# Altium schematic sheet Voltage_DC.SchDoc
size A3; Organization: ORGANIZATION; Address1: ADDRESS 1; Address2: ADDRESS 2; Address3: ADDRESS 3; Address4: ADDRESS 4; Revision: -; SheetNumber: 15; SheetTotal: 19; ENG_APP_DATE: --/--/--; DSN_APP_DATE: --/--/--; CHK_APP_DATE: --/--/--
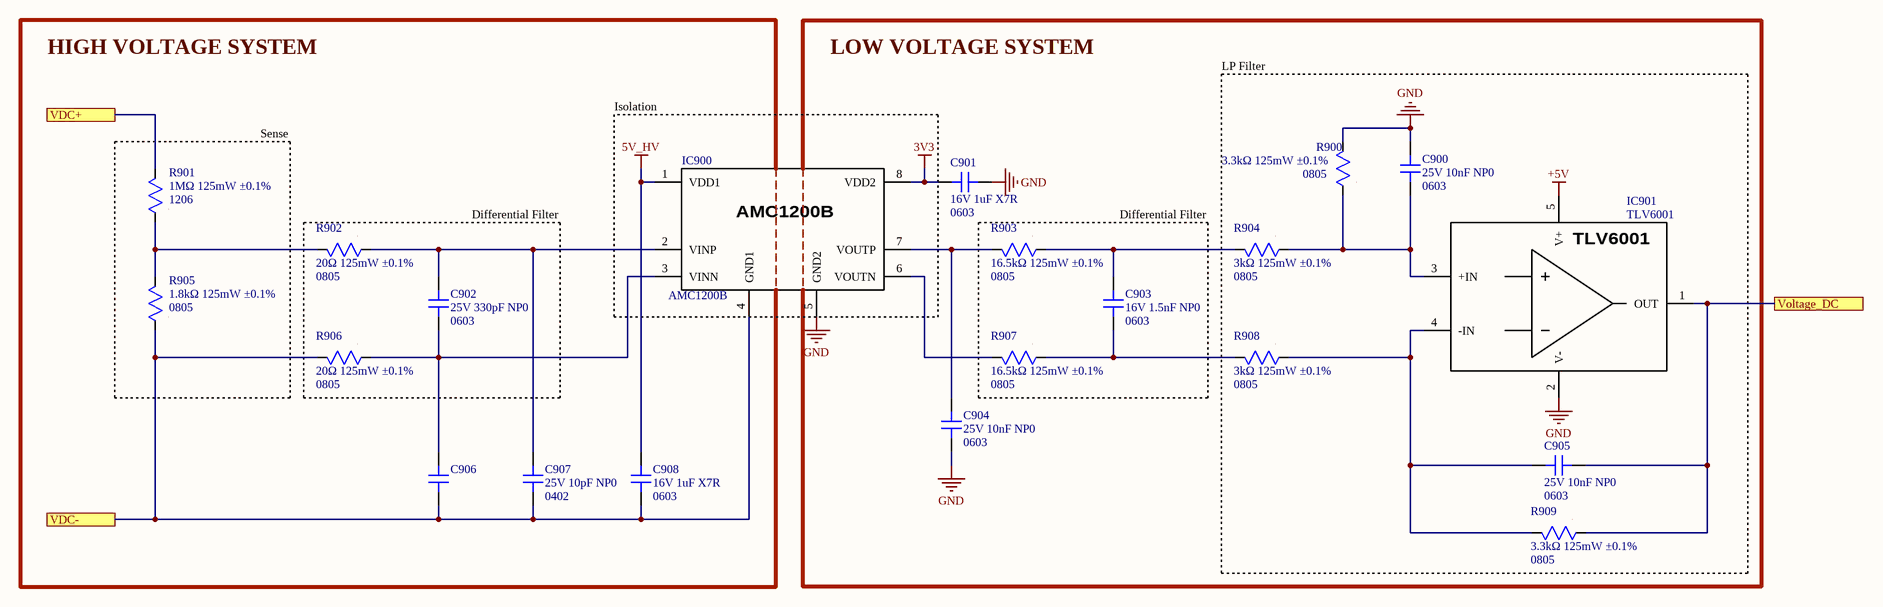
[diagram p0: Voltage_DC.SchDoc]

## Parts
C900  value 25V 10nF NP0  Package: 0603  [CAP SMD 0603]  (hidden comment: CAP non polarized)
C901  value 16V 1uF X7R  Package: 0603  [CAP SMD 0603]  (hidden comment: CAP non polarized)
C902  value 25V 330pF NP0  Package: 0603  [CAP SMD 0603]  (hidden comment: CAP non polarized)
C903  value 16V 1.5nF NP0  Package: 0603  [CAP SMD 0603]  (hidden comment: CAP non polarized)
C904  value 25V 10nF NP0  Package: 0603  [CAP SMD 0603]  (hidden comment: CAP non polarized)
C905  value 25V 10nF NP0  Package: 0603  [CAP SMD 0603]  (hidden comment: CAP non polarized)
C906  CAP non polarized  [CAP SMD 0402]  (value not drawn)
C907  value 25V 10pF NP0  Package: 0402  [CAP SMD 0402]  (hidden comment: CAP non polarized)
C908  value 16V 1uF X7R  Package: 0603  [CAP SMD 0603]  (hidden comment: CAP non polarized)
IC900  AMC1200B  [AMC1200B]
IC901  TLV6001  [SOT-23-5]
R900  value 3.3kΩ 125mW ±0.1%  Package: 0805  [RES SMD 0805]  (hidden comment: RES)
R901  value 1MΩ 125mW ±0.1%  Package: 1206  [RES SMD 1206]  (hidden comment: RES)
R902  value 20Ω 125mW ±0.1%  Package: 0805  [RES SMD 0805]  (hidden comment: RES)
R903  value 16.5kΩ 125mW ±0.1%  Package: 0805  [RES SMD 0805]  (hidden comment: RES)
R904  value 3kΩ 125mW ±0.1%  Package: 0805  [RES SMD 0805]  (hidden comment: RES)
R905  value 1.8kΩ 125mW ±0.1%  Package: 0805  [RES SMD 0805]  (hidden comment: RES)
R906  value 20Ω 125mW ±0.1%  Package: 0805  [RES SMD 0805]  (hidden comment: RES)
R907  value 16.5kΩ 125mW ±0.1%  Package: 0805  [RES SMD 0805]  (hidden comment: RES)
R908  value 3kΩ 125mW ±0.1%  Package: 0805  [RES SMD 0805]  (hidden comment: RES)
R909  value 3.3kΩ 125mW ±0.1%  Package: 0805  [RES SMD 0805]  (hidden comment: RES)

## Blocks framed on the sheet
HIGH VOLTAGE SYSTEM: C902 C906-C908 R901 R902 R905 R906
LOW VOLTAGE SYSTEM: C901 C904
Isolation: IC900
LP Filter: C900 C905 IC901 R900 R904 R908 R909
Differential Filter: C903 R903 R907

## Ports
VDC+, VDC-, Voltage_DC

## Nets
3V3: C901.1 IC900.8(VDD2)
5V_HV: C908.1 IC900.1(VDD1)
+5V: IC901.5(V+)
GND: C900.2 C901.2 C904.2 IC900.5(GND2) IC901.2(V-) R900.2
VDC+: R901.2 ; port VDC+
VDC-: C906.2 C907.2 C908.2 IC900.4(GND1) R905.1 R906.2 ; port VDC-
Voltage_DC: C905.2 IC901.1(OUT) R909.1 ; port Voltage_DC
NetC900_1: C900.1 IC901.3(+IN) R900.1 R904.1
NetC902_1: C902.1 C907.1 IC900.2(VINP) R902.1
NetC902_2: C902.2 C906.1 IC900.3(VINN) R906.1
NetC903_1: C903.1 R903.1 R904.2
NetC903_2: C903.2 R907.1 R908.2
NetC904_1: C904.1 IC900.7(VOUTP) R903.2
NetC905_1: C905.1 IC901.4(-IN) R908.1 R909.2
NetIC900_6: IC900.6(VOUTN) R907.2
NetR901_1: R901.1 R902.2 R905.2

## Notes on the sheet
- Sense
- Differential Filter
- Project:
- Subsystem:
- Company:
- Document:
- Author:
- Revision:
- Date:
- Sheet:
- /

## Library data of the parts
C900 C905 = 001-0107: Condensadores de cerámica multicapa (MLCC- SMD/SMT) 0.01 uF 25 VDC 1% 0603 C0G (NP0) AEC-Q200; MPN: GRT1885C1E103FA02D; Manufacturer: muRata; ComponentLink1Description: Datasheet; ComponentLink1URL: https://www.mouser.es/datasheet/3/76/2/GRT1885C1E103FA02_01A.pdf; ComponentLink2Description: Distributor Link; ComponentLink2URL: https://www.mouser.es/ProductDetail/Murata-Electronics/GRT1885C1E103FA02D?qs=xZ%2FP%252Ba9zWqaqiXqJj78%252Bmg%3D%3D; ID: 001-0107; Distributor PN: 81-GRT1885C1E103FA2D; Distributor: Mouser
C901 C908 = 001-0110: Condensadores de cerámica multicapa (MLCC- SMD/SMT) WCAP-CSGP 1uF 0603 10% 16V MLCC; MPN: 885012206052; Manufacturer: Wurth Elektronik; ComponentLink1Description: Datasheet; ComponentLink1URL: https://www.we-online.com/components/products/datasheet/885012206052.pdf; ComponentLink2Description: Distributor Link; ComponentLink2URL: https://www.mouser.es/ProductDetail/Wurth-Elektronik/885012206052?qs=0KOYDY2FL2%2F2JKabApojcQ%3D%3D; ID: 001-0110; Distributor PN: 710-885012206052; Distributor: Mouser
C902 = 001-0120: Condensadores de cerámica multicapa (MLCC- SMD/SMT) 0603 330pF 25volts C0G 1%; MPN: VJ0603A331FXXCW1BC; Manufacturer: Vishay; ComponentLink1Description: Datasheet; ComponentLink1URL: https://www.vishay.com/docs/28548/vjw1bcbascomseries.pdf; ComponentLink2Description: Distributor Link; ComponentLink2URL: https://www.mouser.es/ProductDetail/Vishay-Vitramon/VJ0603A331FXXCW1BC?qs=%2Fh0R4aLiLgPLKHvkP5P%252BKw%3D%3D; ID: 001-0120; Distributor PN: 77-VJ0603A331FXXCBC; Distributor: Mouser
C903 = 001-0121: Condensadores de cerámica multicapa (MLCC- SMD/SMT) 25V 1500pF C0G 0603 1%; MPN: C0603C152F3GECTU; Manufacturer: KEMET; ComponentLink1Description: Datasheet; ComponentLink1URL: https://www.mouser.es/datasheet/3/508/1/KEM_C1091_C0G_ESD.pdf; ComponentLink2Description: Distributor Link; ComponentLink2URL: https://www.mouser.es/ProductDetail/KEMET/C0603C152F3GECTU?qs=Mv7BduZupUh%252Bk5D8ZWarTg%3D%3D; ID: 001-0121; Distributor PN: 80-C0603C152F3GEC; Distributor: Mouser
C904 = 001-0109: Condensadores de cerámica multicapa (MLCC- SMD/SMT) 50V 5100pF 0603 C0G 1%; MPN: C0603C512F5GACTU; Manufacturer: KEMET; ComponentLink1Description: Datasheet; ComponentLink1URL: https://www.mouser.es/datasheet/3/72/1/C0603C512F5GACTU.pdf; ComponentLink2Description: Distributor Link; ComponentLink2URL: https://www.mouser.es/ProductDetail/KEMET/C0603C512F5GACTU?qs=Fn3VdHBzkcmgqbeAGPfrXg%3D%3D; ID: 001-0109; Distributor PN: 80-C0603C512F5G; Distributor: Mouser
C906 = 001-0119: Condensadores de cerámica multicapa (MLCC- SMD/SMT) 25V 10pF C0G 0402 0. 1pF; MPN: 04023A100BAT2A; Manufacturer: KYOCERA AVX; Value: 25V 10pF NP0; ComponentLink1Description: Datasheet; ComponentLink1URL: https://www.mouser.es/datasheet/3/5926/1/C0GNP0_Dielectric.pdf; ComponentLink2Description: Distributor Link; ComponentLink2URL: https://www.mouser.es/ProductDetail/KYOCERA-AVX/04023A100BAT2A?qs=Op3aA%252BNiUY5yU4vAZ7xiKg%3D%3D; Package: 0402; ID: 001-0119; Distributor PN: 581-04023A100BAT2A; Distributor: Mouser
C907 = 001-0119: Condensadores de cerámica multicapa (MLCC- SMD/SMT) 25V 10pF C0G 0402 0. 1pF; MPN: 04023A100BAT2A; Manufacturer: KYOCERA AVX; ComponentLink1Description: Datasheet; ComponentLink1URL: https://www.mouser.es/datasheet/3/5926/1/C0GNP0_Dielectric.pdf; ComponentLink2Description: Distributor Link; ComponentLink2URL: https://www.mouser.es/ProductDetail/KYOCERA-AVX/04023A100BAT2A?qs=Op3aA%252BNiUY5yU4vAZ7xiKg%3D%3D; ID: 001-0119; Distributor PN: 581-04023A100BAT2A; Distributor: Mouser
IC900 = 062-0001: Amplificadores de aislamiento 4kV peak Iso Amp A 5 95-AMC1200BDUB A 59 A 595-AMC1200BDUB; MPN: AMC1200BDUBR; Manufacturer: Texas Instruments; ID: 062-0001; ComponentLink1URL: https://www.ti.com/lit/ds/symlink/amc1200.pdf?ts=1781612882045&ref_url=https%253A%252F%252Fwww.ti.com%252Fproduct%252FAMC1200%253FkeyMatch%253DAMC1200%2526tisearch%253Duniversal_search%2526usecase%253DGPN-ALT; ComponentLink2URL: https://www.mouser.es/ProductDetail/Texas-Instruments/AMC1200BDUBR?qs=4whTb%2F0XQMjhZwrxk0lf%2FQ%3D%3D; Value: -; Package: SOP-8; Distributor PN: 595-AMC1200BDUBR; Distributor: Mouser
IC901 = 062-0002: Amplificadores operacionales - Op Amps Single 5.5-V 1-MHz R RIO operational a A A 595-TLV6001UIDBVT; MPN: TLV6001UIDBVR; Manufacturer: Texas Instruments; ID: 062-0002; ComponentLink1URL: https://www.ti.com/lit/ds/symlink/tlv6001.pdf?ts=1781607824916&ref_url=https%253A%252F%252Fcz.mouser.com%252F; ComponentLink2URL: https://www.mouser.es/ProductDetail/Texas-Instruments/TLV6001UIDBVR?qs=8N88piwwHEgntIgM8jjJ5Q%3D%3D; Value: -; Package: SOT-23-5; Distributor PN: 595-TLV6001UIDBVR; Distributor: Mouser
R900 R909 = 010-0154: Thin Film Resistors 0805 3.3Kohm 0.1% 15ppm AEC-Q200; MPN: ERA-6APB332V; Manufacturer: Panasonic; ComponentLink1Description: Datasheet; ComponentLink1URL: https://industrial.panasonic.com/cdbs/www-data/pdf/RDM0000/AOA0000C307.pdf; ComponentLink2Description: Distributor Link; ComponentLink2URL: https://www.mouser.es/ProductDetail/Panasonic/ERA-6APB332V?qs=sGAEpiMZZMvdGkrng054t7Q%2FBjLwFmgicQi9zKDLbrs%3D; ID: 010-0154; Distributor PN: 667-ERA-6APB332V; Distributor: Mouser
R901 = 010-0161: Thin Film Resistors CHIP RESISTOR Precision; MPN: CRT1206-BW-1004ELF; Manufacturer: Bourns; ComponentLink1Description: Datasheet; ComponentLink1URL: https://www.mouser.es/datasheet/3/40/1/CRT.pdf; ComponentLink2Description: Distributor Link; ComponentLink2URL: https://www.mouser.es/ProductDetail/Bourns/CRT1206-BW-1004ELF?qs=sGAEpiMZZMvdGkrng054t9uZ12tsVZVXUwFPKPuMiMw%3D; ID: 010-0161; Distributor PN: 652-CRT1206BW1004ELF; Distributor: Mouser
R902 R906 = 010-0163: Thin Film Resistors RP 2A 20R 0.1% 15PPM CUT LENGTH; MPN: RP73D2A20RBTG; Manufacturer: TE; ComponentLink1Description: Datasheet; ComponentLink1URL: https://www.te.com/commerce/DocumentDelivery/DDEController?Action=showdoc&DocId=Data+Sheet%7F1773272%7FL%7Fpdf%7FEnglish%7FENG_DS_1773272_L.pdf%7F; ComponentLink2Description: Distributor Link; ComponentLink2URL: https://www.mouser.es/ProductDetail/TE-Connectivity-Holsworthy/RP73D2A20RBTG?qs=sGAEpiMZZMvdGkrng054t9WFtWtrbdtG%2F6%2Fjgh8ECZ8%3D; ID: 010-0163; Distributor PN: 279-RP73D2A20RBTG; Distributor: Mouser
R903 R907 = 010-0167: Thin Film Resistors 0805 Thin film chip resistor; MPN: ERA-6ARB1652V; Manufacturer: Panasonic; ComponentLink1Description: Datasheet; ComponentLink1URL: https://industrial.panasonic.com/cdbs/www-data/pdf/RDM0000/AOA0000C307.pdf; ComponentLink2Description: Distributor Link; ComponentLink2URL: https://www.mouser.es/ProductDetail/Panasonic/ERA-6ARB1652V?qs=sGAEpiMZZMvdGkrng054t%2FDNinWxsEFqx8wKlfWZmnLEWdfrAdOy9w%3D%3D; ID: 010-0167; Distributor PN: 667-ERA-6ARB1652V; Distributor: Mouser
R904 R908 = 010-0168: Thin Film Resistors 0805 3Kohm 0.1% 15ppm AEC-Q200; MPN: ERA-6APB302V; Manufacturer: Panasonic; ComponentLink1Description: Datasheet; ComponentLink1URL: https://industrial.panasonic.com/cdbs/www-data/pdf/RDM0000/AOA0000C307.pdf; ComponentLink2Description: Distributor Link; ComponentLink2URL: https://www.mouser.es/ProductDetail/Panasonic/ERA-6APB302V?qs=sGAEpiMZZMvdGkrng054t7Q%2FBjLwFmgiNXNWyxy63ps%3D; ID: 010-0168; Distributor PN: 667-ERA-6APB302V; Distributor: Mouser
R905 = 010-0162: Thin Film Resistors 0805 1.8Kohm 0.1% 10ppm AEC-Q200; MPN: ERA-6ARB182V; Manufacturer: Panasonic; ComponentLink1Description: Datasheet; ComponentLink1URL: https://industrial.panasonic.com/cdbs/www-data/pdf/RDM0000/AOA0000C307.pdf; ComponentLink2Description: Distributor Link; ComponentLink2URL: https://www.mouser.es/ProductDetail/Panasonic/ERA-6ARB182V?qs=sGAEpiMZZMvdGkrng054t7Q%2FBjLwFmgiTwW2qqIgdzU%3D; ID: 010-0162; Distributor PN: 667-ERA-6ARB182V; Distributor: Mouser